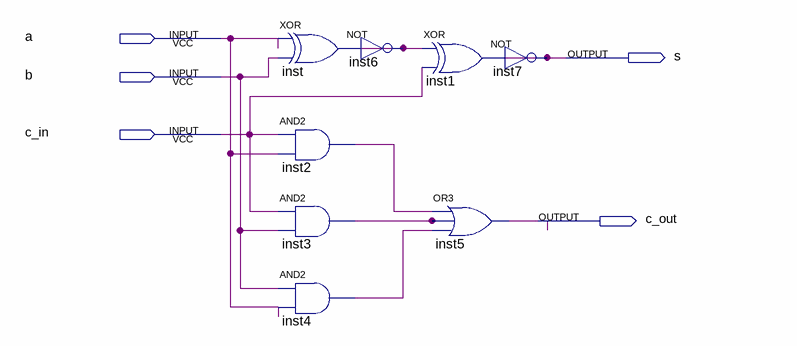
[diagram p0: schematic sheet]
// Quartus schematic fulladder_lab3.bdf as structural Verilog: 8 symbols, 5 pins
module fulladder_lab3 (
  input  a,
  input  b,
  input  c_in,
  output s,
  output c_out
);

  wire inst2_out, inst3_out, inst4_out, inst_out;

  xor inst (inst_out, a, b);
  and inst2 (inst2_out, c_in, a);
  and inst3 (inst3_out, c_in, b);
  and inst4 (inst4_out, b, a);
  // NOT inst6 has open pins: IN=open, OUT=inst_out
  xor inst1 (s, inst_out, c_in);
  or inst5 (c_out, inst2_out, inst3_out, inst4_out);
  // NOT inst7 has open pins: IN=open, OUT=s
endmodule
